# EAGLE design pcb_2 (EAGLE 5.06)
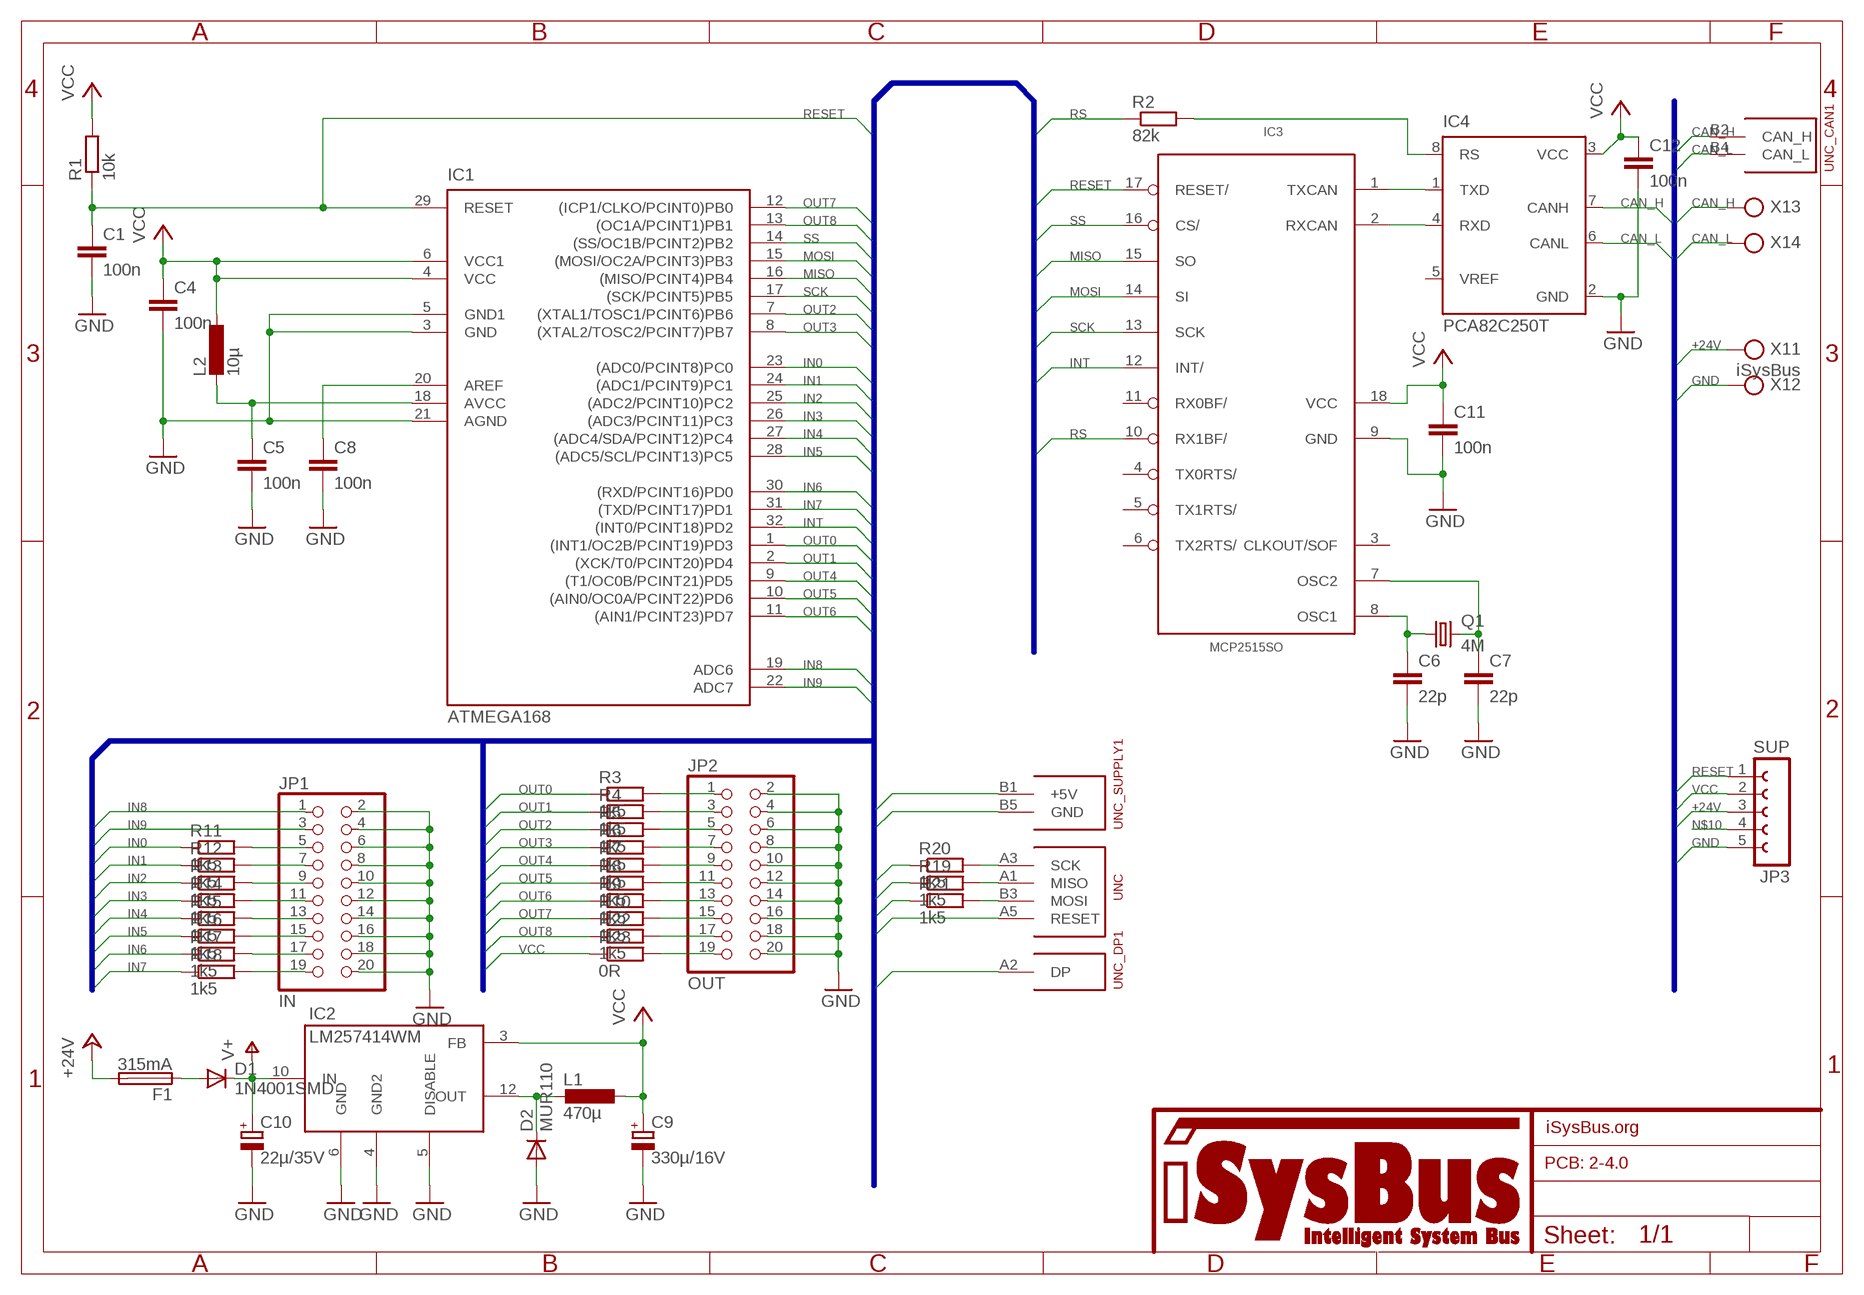
[diagram p0: schematic, sheet 1]

## Parts
C1  100n  CC0805  [C0805]
C4  100n  CC0805  [C0805]
C5  100n  CC0805  [C0805]
C6  22p  CC0805  [C0805]
C7  22p  CC0805  [C0805]
C8  100n  CC0805  [C0805]
C9  330µ/16V  CPOL-EU153CLV-0810  [153CLV-0810]
C10  22µ/35V  CPOL-EU153CLV-0605  [153CLV-0605]
C11  100n  CC0805  [C0805]
C12  100n  CC0805  [C0805]
D1  1N4001SMD  [MELF]
D2  MUR110  [DO41-10]
F1  315mA  19560  [19560]
IC1  ATMEGA168  [TQFP32-08]
IC2  LM257414WM  [14WM]
IC3  MCP2515SO  [SO18L]
IC4  PCA82C250T  [SO08]
JP1  IN  PINHD-2X10  [2X10]
JP2  OUT  PINHD-2X10  [2X10]
JP3  SUP  FE05-1  [FE05-1]
L1  470µ  L-0207/12  [0207/12]
L2  10µ  L-L0805  [L0805]
Q1  4M  CRYSTALHC49UP  [HC49UP]
R1  10k  R-R0805  [R0805]
R2  82k  R-R0805  [R0805]
R3  1k5  R-R0805  [R0805]
R4  1k5  R-R0805  [R0805]
R5  1k5  R-R0805  [R0805]
R6  1k5  R-R0805  [R0805]
R7  1k5  R-R0805  [R0805]
R8  1k5  R-R0805  [R0805]
R9  1k5  R-R0805  [R0805]
R10  1k5  R-R0805  [R0805]
R11  1k5  R-R0805  [R0805]
R12  1k5  R-R0805  [R0805]
R13  1k5  R-R0805  [R0805]
R14  1k5  R-R0805  [R0805]
R15  1k5  R-R0805  [R0805]
R16  1k5  R-R0805  [R0805]
R17  1k5  R-R0805  [R0805]
R18  1k5  R-R0805  [R0805]
R19  1k5  R-R0805  [R0805]
R20  1k5  R-R0805  [R0805]
R21  1k5  R-R0805  [R0805]
R22  1k5  R-R0805  [R0805]
R23  0R  R-R0805  [R0805]
U$1  ISYSBUS_LOGO  [ISYSBUS_LOGO]
U$2  FIELD_ISB_PLACE  [FIELD_ISB_PLACE]
U$3  2-4.0  FIELD_PCB_PLACE  [FIELD_PCB_PLACE]
UNC  UNC_ISP  [UNC_PADS_ISP]
UNC_CAN1  UNC_CAN  [UNC_PADS_CAN]
UNC_DP1  UNC_DP  [UNC_PADS_DP]
UNC_SUPPLY1  UNC_SUPPLY  [UNC_PADS_SUPPLY]
X1  iSysBus  PHOENIX_FK-MPT_4  [PHOENIX_FK-MPT_4]

## Nets
+24V: F1.2 JP3.3 X1.1
CAN_H: IC4.7(CANH) UNC_CAN1.B2(CAN_H) X1.3
CAN_L: IC4.6(CANL) UNC_CAN1.B4(CAN_L) X1.4
GND: C1.2 C4.2 C5.2 C6.2 C7.2 C8.2 C9.- C10.- C11.2 C12.2 D2.A IC1.3(GND) IC1.5(GND1) IC1.21(AGND) IC2.4(GND2) IC2.5(DISABLE) IC2.6(GND) IC3.9(GND) IC4.2(GND) JP1.2 JP1.4 JP1.6 JP1.8 JP1.10 JP1.12 JP1.14 JP1.16 JP1.18 JP1.20 JP2.2 JP2.4 JP2.6 JP2.8 JP2.10 JP2.12 JP2.14 JP2.16 JP2.18 JP2.20 JP3.5 UNC_SUPPLY1.B5(GND) X1.2
IN0: IC1.23((ADC0/PCINT8)PC0) R11.1
IN1: IC1.24((ADC1/PCINT9)PC1) R12.1
IN2: IC1.25((ADC2/PCINT10)PC2) R13.1
IN3: IC1.26((ADC3/PCINT11)PC3) R14.1
IN4: IC1.27((ADC4/SDA/PCINT12)PC4) R15.1
IN5: IC1.28((ADC5/SCL/PCINT13)PC5) R16.1
IN6: IC1.30((RXD/PCINT16)PD0) R17.1
IN7: IC1.31((TXD/PCINT17)PD1) R18.1
IN8: IC1.19(ADC6) JP1.1
IN9: IC1.22(ADC7) JP1.3
INT: IC1.32((INT0/PCINT18)PD2) IC3.12(INT/)
MISO: IC1.16((MISO/PCINT4)PB4) IC3.15(SO) R19.1
MOSI: IC1.15((MOSI/OC2A/PCINT3)PB3) IC3.14(SI) R21.1
N$1: D1.A F1.1
N$2: C5.1 IC1.18(AVCC) L2.2
N$3: D2.C IC2.12(OUT) L1.2
N$4: IC4.8(RS) R2.2
N$5: C6.1 IC3.8(OSC1) Q1.1
N$6: C8.1 IC1.20(AREF)
N$7: IC3.1(TXCAN) IC4.1(TXD)
N$8: IC3.2(RXCAN) IC4.4(RXD)
N$9: C7.1 IC3.7(OSC2) Q1.2
N$10: JP3.4
N$11: JP2.19 R23.2
N$12: JP2.1 R3.2
N$13: JP2.3 R4.2
N$14: JP2.5 R5.2
N$15: JP2.7 R6.2
N$16: JP2.9 R7.2
N$17: JP2.11 R8.2
N$18: JP2.13 R9.2
N$19: JP2.15 R10.2
N$20: JP1.19 R18.2
N$21: JP1.17 R17.2
N$22: JP1.15 R16.2
N$23: JP1.13 R15.2
N$24: JP1.11 R14.2
N$25: JP1.9 R13.2
N$26: JP1.7 R12.2
N$27: JP1.5 R11.2
N$29: R20.2 UNC.A3(SCK)
N$30: R19.2 UNC.A1(MISO)
N$31: R21.2 UNC.B3(MOSI)
N$32: JP2.17 R22.2
OUT0: IC1.1((INT1/OC2B/PCINT19)PD3) R3.1
OUT1: IC1.2((XCK/T0/PCINT20)PD4) R4.1
OUT2: IC1.7((XTAL1/TOSC1/PCINT6)PB6) R5.1
OUT3: IC1.8((XTAL2/TOSC2/PCINT7)PB7) R6.1
OUT4: IC1.9((T1/OC0B/PCINT21)PD5) R7.1
OUT5: IC1.10((AIN0/OC0A/PCINT22)PD6) R8.1
OUT6: IC1.11((AIN1/PCINT23)PD7) R9.1
OUT7: IC1.12((ICP1/CLKO/PCINT0)PB0) R10.1
OUT8: IC1.13((OC1A/PCINT1)PB1) R22.1
RESET: C1.1 IC1.29(RESET) IC3.17(RESET/) JP3.1 R1.1 UNC.A5(RESET)
RS: IC3.10(RX1BF/) R2.1
SCK: IC1.17((SCK/PCINT5)PB5) IC3.13(SCK) R20.1
SS: IC1.14((SS/OC1B/PCINT2)PB2) IC3.16(CS/)
V+: C10.+ D1.C IC2.10(IN)
VCC: C4.1 C9.+ C11.1 C12.1 IC1.4(VCC) IC1.6(VCC1) IC2.3(FB) IC3.18(VCC) IC4.3(VCC) JP3.2 L1.1 L2.1 R1.2 R23.1 UNC_DP1.A2(DP) UNC_SUPPLY1.B1(+5V)
Unconnected: IC3.3(CLKOUT/SOF) IC3.4(TX0RTS/) IC3.5(TX1RTS/) IC3.6(TX2RTS/) IC3.11(RX0BF/) IC4.5(VREF)

## Buses
VCC,GND,RESET,SCK,MISO,MOSI,SS,INT,RS,IN[0..9],OUT[0..8]
+24V,VCC,GND,CAN_H,CAN_L,RESET

## Library data of the parts
C1 C4-C8 C11 C12 = isb_capacitors:C: CAPACITOR, European symbol
C9 C10 = rcl:CPOL-EU: POLARIZED CAPACITOR, European symbol
D1 = isb_diodes:1N4001
D2 = isb_diodes:MUR110
F1 = isb_supply:19560: FUSE HOLDER TR5, Wickmann
IC1 = isb_microcontrollers:ATMEGA168
IC2 = isb_supply:LM2574
IC3 = isb_interfacecontrollers:MCP2515
IC4 = isb_interfacecontrollers:PCA82C250
JP1 JP2 = pinhead:PINHD-2X10: PIN HEADER
JP3 = con-lsta:FE05-1: FEMALE HEADER
L1 L2 = isb_inductors:L: INDUCTOR, European symbol
Q1 = crystal:CRYSTAL: CRYSTAL
R1-R23 = isb_resistors:R: RESISTOR, European symbol
U$1 = isysbus_misc:ISYSBUS_LOGO: iSysBus Logo
U$2 = isb_misc:FIELD_ISB
U$3 = isb_misc:FIELD_PCB
UNC = isb_connectors:UNC_ISP: ISP-Schnittstelle Für korrekte Funktionsweise wird UNC_SUPPLY benötigt!
UNC_CAN1 = isb_connectors:UNC_CAN: CAN-Schnittstelle Für korrekten Betrieb wird UNC_SUPPLY benötigt!
UNC_DP1 = isb_connectors:UNC_DP: Wird der DP-Pin eines UNC mit +5V verbunden, kann ein angeschlossenes Gerät automatisch erkannt werden
UNC_SUPPLY1 = isb_connectors:UNC_SUPPLY: Spannungsversorgung für UNC
X1 = isb_connectors:PHOENIX_FK-MPT_4

## Board
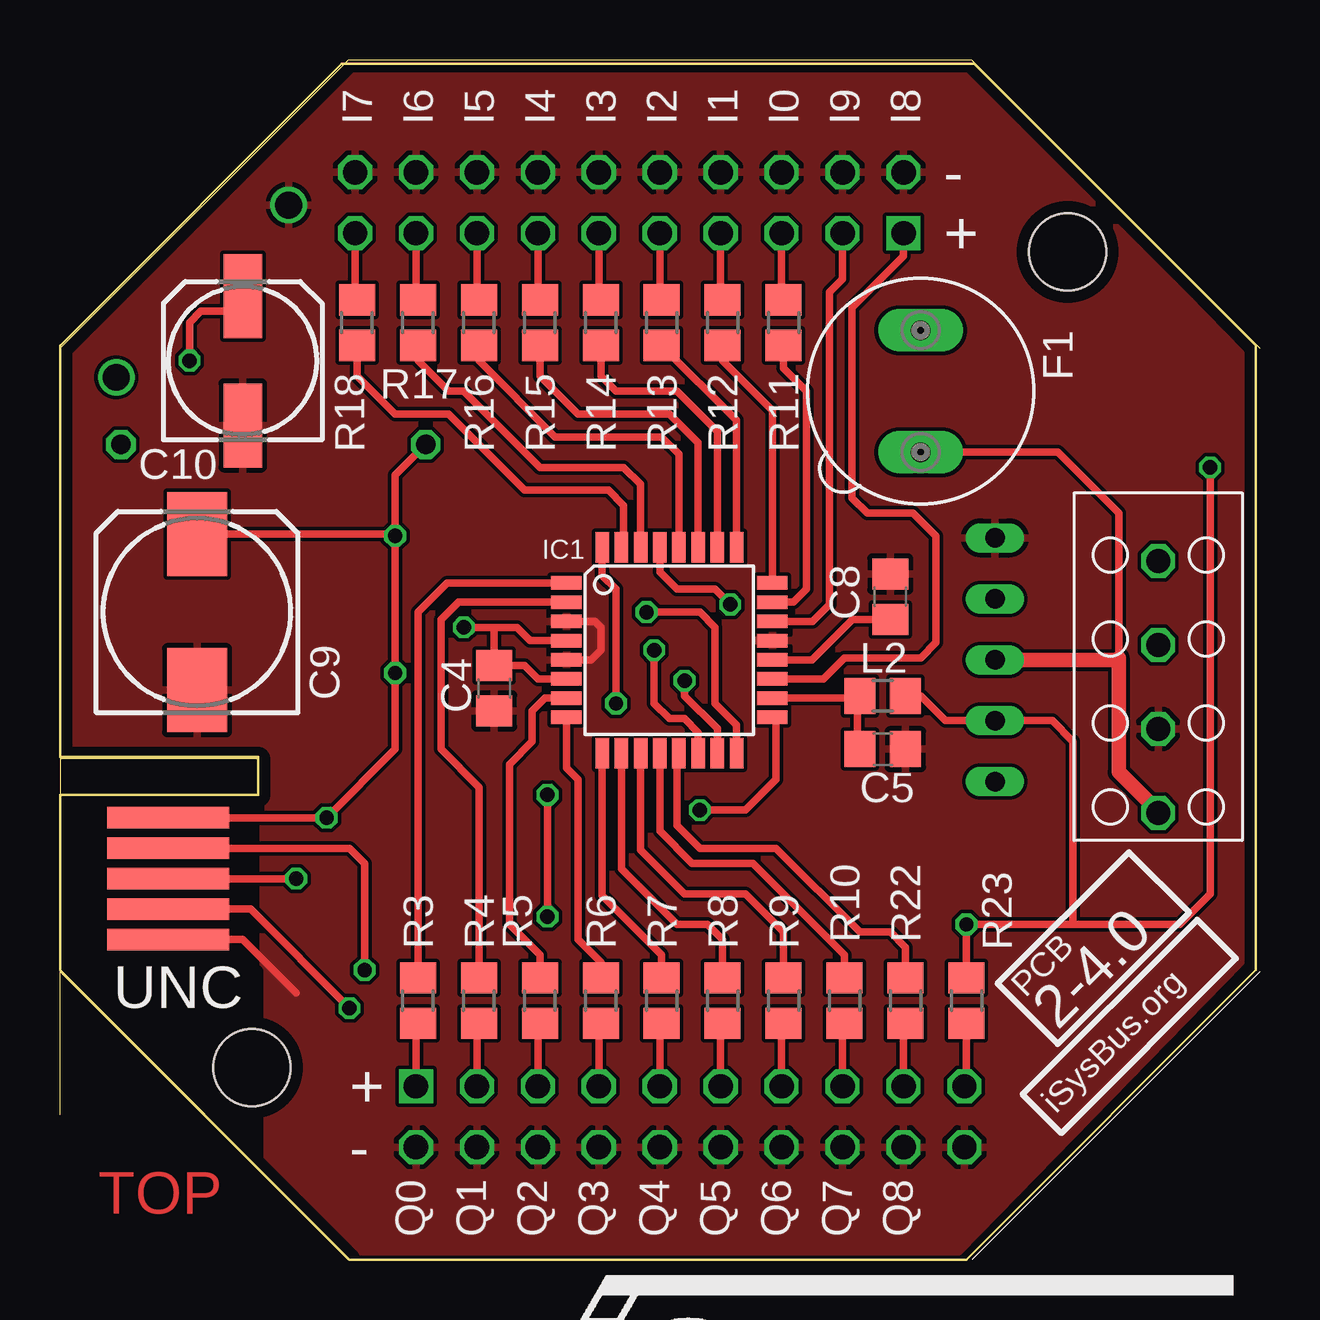
[diagram p1: board, top side]
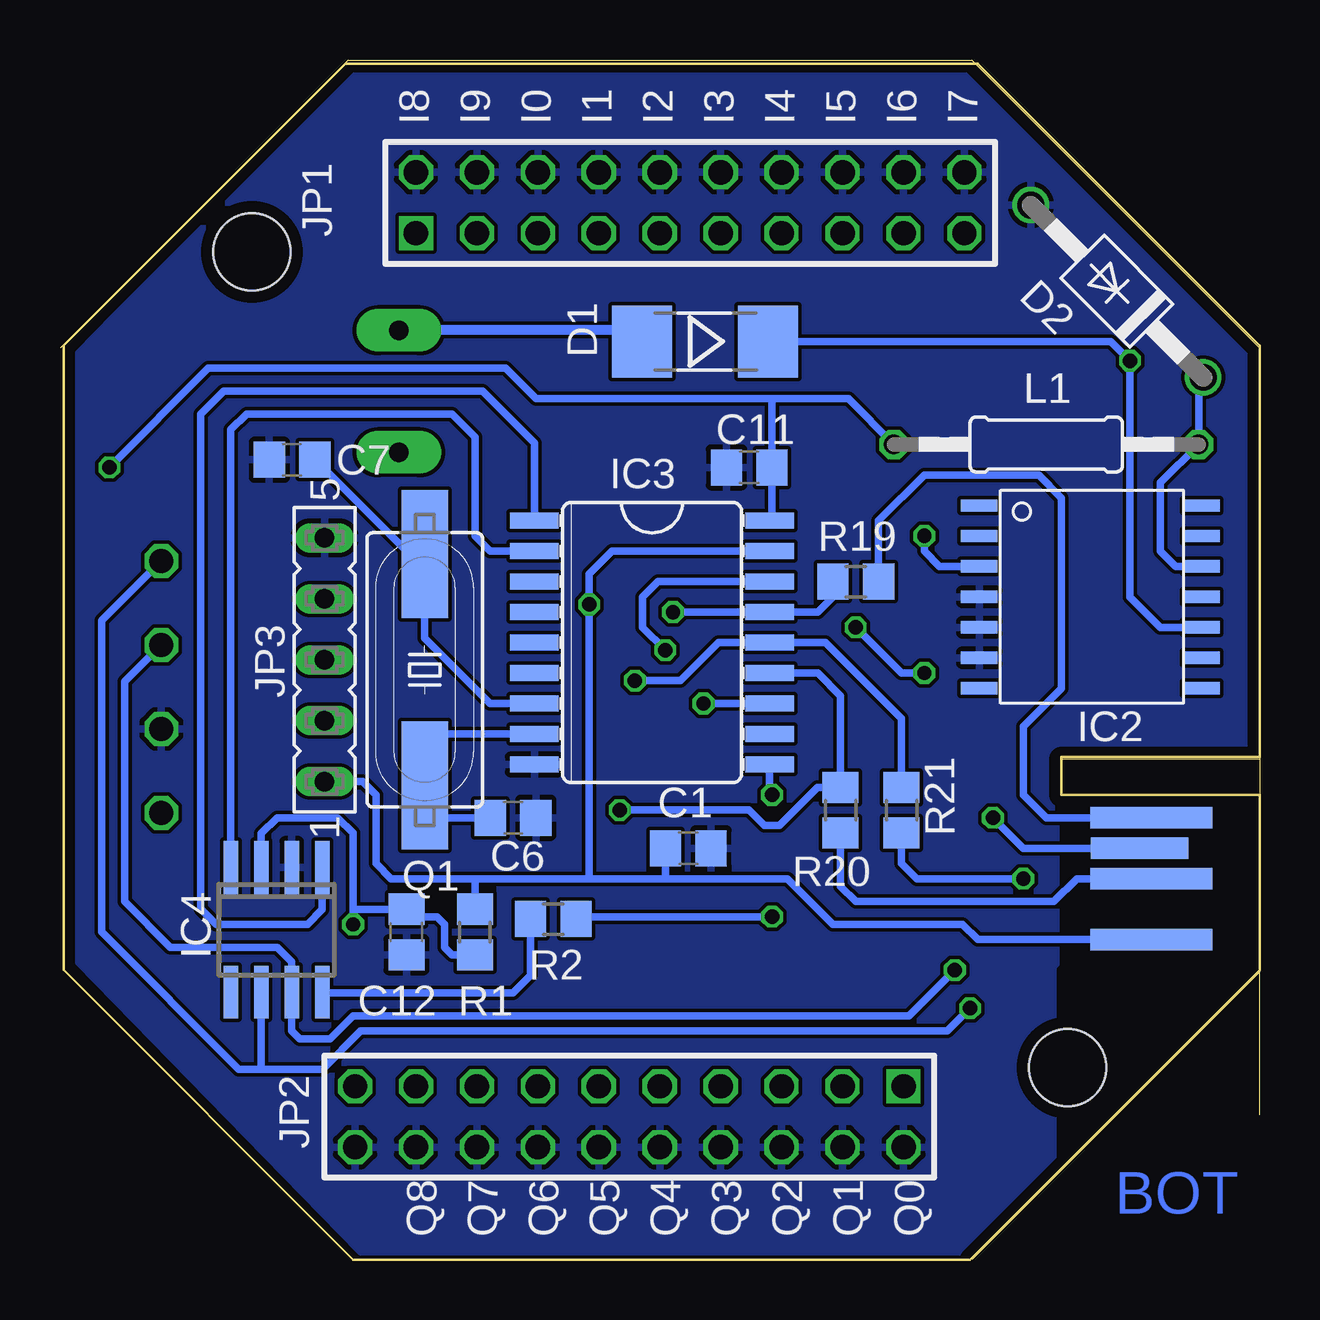
[diagram p2: board, bottom side, seen from below]

Size 50 x 50 mm. Coordinates in mm from the lower left corner, seen from the top.
Outline: 50,38 38,50 12,50 0,38 0,12 12,0
Copper layers (1*16): Top 0.035mm / dielectric 1.5mm / Bottom 0.035mm
Design rules: minimum track width 6mil, minimum drill 12mil, track to track 6mil, track to pad 6mil, pad to pad 6mil, via to via 6mil, smd to smd 6mil, copper to edge 20mil, drill to drill 8mil, minimum pad ring 8mil, minimum via ring 6mil, stop-mask expansion 3mil, vias tented up to drill 0mil, thermal gap 8mil
Holes 3.2 mm at 8,8 42,42
tKeepout: area 6.1,6.1 to 12.1,12.1; area 37.6,37.6 to 43.6,43.6
bKeepout: area 6.1,6.1 to 12.1,12.1; area 37.6,37.6 to 43.6,43.6
tRestrict: area 0,4.4 to 8.3,12.1
bRestrict: area 0,4.4 to 8.3,12.1
Milling: 12 lines

### Footprints (pad centres in the part's own frame; a part is rotated, then mirrored left to right if it is on the bottom)
C0805 = smd 1.3 x 1.5: 1 -0.95,0; 2 0.95,0
153CLV-0810 = smd 3.5 x 2.5: + 3.25,0; - -3.25,0
153CLV-0605 = smd 3.5 x 1.6: + 2.7,0; - -2.7,0
MELF = smd 2.5 x 3: A 2.625,0; C -2.625,0
DO41-10 = drill 1.118: A 5.08,0; C -5.08,0
19560 = drill 0.813 pad 1.778 long: 1 -2.54,0; 2 2.54,0
TQFP32-08 = smd 1.27 x 0.559: 1 -4.293,2.8; 2 -4.293,2; 3 -4.293,1.2; 4 -4.293,0.4; 5 -4.293,-0.4; 6 -4.293,-1.2; 7 -4.293,-2; 8 -4.293,-2.8; 17 4.293,-2.8; 18 4.293,-2; 19 4.293,-1.2; 20 4.293,-0.4; 21 4.293,0.4; 22 4.293,1.2; 23 4.293,2; 24 4.293,2.8 | smd 0.559 x 1.27: 9 -2.8,-4.293; 10 -2,-4.293; 11 -1.2,-4.293; 12 -0.4,-4.293; 13 0.4,-4.293; 14 1.2,-4.293; 15 2,-4.293; 16 2.8,-4.293; 25 2.8,4.293; 26 2,4.293; 27 1.2,4.293; 28 0.4,4.293; 29 -0.4,4.293; 30 -1.2,4.293; 31 -2,4.293; 32 -2.8,4.293
14WM = smd 0.508 x 1.524: 1 -3.175,-4.699; 2 -1.905,-4.699; 3 -0.635,-4.699; 4 0.635,-4.699; 5 1.905,-4.699; 6 3.175,-4.699; 7 4.445,-4.699; 8 4.445,4.572; 9 3.175,4.572; 10 1.905,4.572; 11 0.635,4.572; 12 -0.635,4.572; 13 -1.905,4.572; 14 -3.175,4.572
SO18L = smd 0.66 x 2.032: 1 -5.08,-4.902; 2 -3.81,-4.902; 3 -2.54,-4.902; 4 -1.27,-4.902; 5 0,-4.902; 6 1.27,-4.902; 7 2.54,-4.902; 8 3.81,-4.902; 9 5.08,-4.902; 10 5.08,4.902; 11 3.81,4.902; 12 2.54,4.902; 13 1.27,4.902; 14 0,4.902; 15 -1.27,4.902; 16 -2.54,4.902; 17 -3.81,4.902; 18 -5.08,4.902
SO08 = smd 0.6 x 2.2: 1 -1.905,-2.6; 2 -0.635,-2.6; 3 0.635,-2.6; 4 1.905,-2.6; 5 1.905,2.6; 6 0.635,2.6; 7 -0.635,2.6; 8 -1.905,2.6
2X10 = drill 1.016 square: 1 -11.43,-1.27 | drill 1.016 octagon: 2 -11.43,1.27; 3 -8.89,-1.27; 4 -8.89,1.27; 5 -6.35,-1.27; 6 -6.35,1.27; 7 -3.81,-1.27; 8 -3.81,1.27; 9 -1.27,-1.27; 10 -1.27,1.27; 11 1.27,-1.27; 12 1.27,1.27; 13 3.81,-1.27; 14 3.81,1.27; 15 6.35,-1.27; 16 6.35,1.27; 17 8.89,-1.27; 18 8.89,1.27; 19 11.43,-1.27; 20 11.43,1.27
FE05-1 = drill 0.813 long: 1 -5.08,0; 2 -2.54,0; 3 0,0; 4 2.54,0; 5 5.08,0
0207/12 = drill 0.813 octagon: 1 -6.35,0; 2 6.35,0
L0805 = smd 1.3 x 1.5: 1 -0.95,0; 2 0.95,0
HC49UP = smd 5.334 x 1.93: 1 -4.826,0; 2 4.826,0
R0805 = smd 1.3 x 1.5: 1 -0.95,0; 2 0.95,0
UNC_PADS_ISP = smd 0.91 x 5.08 bottom: A1 2.54,4.508; A3 5.08,4.508; A5 7.62,4.508 | smd 0.91 x 5.08: B3 5.08,4.508
UNC_PADS_CAN = smd 0.91 x 5.08: B2 3.81,4.508; B4 6.35,4.508
UNC_PADS_DP = smd 0.91 x 4.08 bottom: A2 3.81,5
UNC_PADS_SUPPLY = smd 0.91 x 5.08: B1 2.54,4.508; B5 7.62,4.508
PHOENIX_FK-MPT_4 = drill 1 octagon: 1 -5.25,0; 2 -1.75,0; 3 1.75,0; 4 5.25,0

### Placement (x,y rotation side)
C1  23.81,17.14 0 bottom
C4  18.1,23.81 270 top
C5  34.29,21.27 0 top
C6  31.11,18.41 0 bottom
C7  40.32,33.34 180 bottom
C8  34.61,27.62 90 top
C9  5.71,26.99 90 top
C10  7.62,37.47 90 top
C11  21.27,33.02 180 bottom
C12  35.56,13.65 270 bottom
D1  23.12,38.26 180 bottom
D2  5.94,40.36 135 bottom
F1  35.88,36.2 270 top
IC1  25.4,25.4 0 top
IC2  6.99,28.26 270 bottom
IC3  25.32,25.72 270 bottom
IC4  40.97,13.75 180 bottom
JP1  23.73,44.05 0 bottom
JP2  26.27,5.95 180 bottom
JP3  38.97,25 90 bottom
L1  8.89,33.97 0 bottom
L2  34.29,23.5 180 top
Q1  34.79,24.58 90 bottom
R1  32.7,13.65 270 bottom
R2  29.43,14.19 180 bottom
R3  14.92,10.79 270 top
R4  17.46,10.79 270 top
R5  20,10.79 270 top
R6  22.54,10.79 270 top
R7  25.08,10.79 270 top
R8  27.62,10.79 270 top
R9  30.16,10.79 270 top
R10  32.7,10.79 270 top
R11  30.16,39.05 90 top
R12  27.62,39.05 90 top
R13  25.08,39.05 90 top
R14  22.54,39.05 90 top
R15  20,39.05 90 top
R16  17.46,39.05 90 top
R17  14.92,39.05 90 top
R18  12.38,39.05 90 top
R19  16.83,28.26 0 bottom
R20  17.46,18.73 270 bottom
R21  14.92,18.73 270 bottom
R22  35.24,10.79 270 top
R23  37.78,10.79 270 top
U$1  21.59,-10.79 0 top  (outside the outline)
U$2  42.64,4.91 45 top
U$3  41.59,9.53 45 top
UNC  0,20.95 270 top
UNC_CAN1  0,20.95 270 top
UNC_DP1  0,20.95 270 top
UNC_SUPPLY1  0,20.95 270 top
X1  45.77,23.87 90 top

### Tracks (layer width: path | path; a pad name or v marks a point on that pad's centre or on a via)
+24V
  Top 0.305: 45.77,18.68 X1.1 | 44.05,25 44.13,25.08 44.13,31.11 41.59,33.66 F1.2
  Top 0.61: 45.77,18.68 44.13,20.32 44.13,25.08 | JP3.3 44.05,25
CAN_H  (via drill 0.6)
  Top 0.305: UNC_CAN1.B2 12.06,17.14 12.7,16.51 v12.7,12.06
  Bottom 0.305: X1.3 47.31,24.08 47.31,14.92 45.4,13.02 40.96,13.02 40.34,12.4 IC4.7 40.34,9.54 40.01,9.21 38.73,9.21 37.78,10.16 14.61,10.16 v12.7,12.06
CAN_L  (via drill 0.6)
  Top 0.305: UNC_CAN1.B4 7.94,14.61 v12.06,10.48
  Bottom 0.305: 41.61,7.95 IC4.6 | X1.4 48.26,26.63 48.26,13.65 42.55,7.94 41.62,7.94 41.61,7.95 | 41.61,7.95 41.59,7.94 39.05,7.94 37.47,9.53 13.02,9.53 v12.06,10.48
GND
  Top 0.305: IC1.5 22.14,25 22.54,25.4 22.54,26.35 22.3,26.6 IC1.3 | UNC_SUPPLY1.B5 7.62,13.34 9.84,11.11
  pour Bottom: 0.32,37.78 12.06,49.53 37.78,49.53 49.21,37.78 49.21,12.38 37.47,0.32 12.38,0.32 0.32,12.06
  pour Top: 0.32,37.78 12.06,49.53 37.78,49.53 49.21,37.78 49.21,12.38 37.47,0.32 12.38,0.32 0.32,12.06
IN0
  Top 0.305: IC1.23 30.57,27.4 31.11,27.94 31.11,36.2 30.16,37.15 R11.1
IN1
  Top 0.305: R12.1 27.62,37.47 29.69,35.4 IC1.24
IN2
  Top 0.305: IC1.25 28.2,34.98 R13.1
IN3
  Top 0.305: IC1.26 27.4,34.51 25.72,36.2 23.18,36.2 22.54,36.83 R14.1
IN4
  Top 0.305: IC1.27 26.6,34.04 25.4,35.24 21.59,35.24 20,36.83 R15.1
IN5
  Top 0.305: IC1.28 25.8,33.57 25.08,34.29 20.64,34.29 17.46,37.47 R16.1
IN6
  Top 0.305: IC1.30 24.2,32.31 23.5,33.02 20,33.02 16.83,36.2 16.19,36.2 14.92,37.47 R17.1
IN7
  Top 0.305: IC1.31 23.5,29.79 23.5,31.43 22.86,32.07 19.37,32.07 16.19,35.24 13.97,35.24 12.38,36.83 R18.1
IN8
  Top 0.305: 29.76,24.13 IC1.19 31.82,24.2 32.7,25.08 35.88,25.08 36.51,25.72 36.51,30.16 35.56,31.11 33.66,31.11 33.02,31.75 33.02,39.69 35.16,41.83 JP1.1
IN9
  Top 0.305: IC1.22 31.36,26.6 32.07,27.3 32.07,37.15 32.07,40.32 32.62,40.88 JP1.3
INT  (via drill 0.6)
  Top 0.305: IC1.32 22.6,28.52 23.18,27.94 v23.18,23.18
  Bottom 0.305: IC3.12 v23.18,23.18
MISO  (via drill 0.6)
  Top 0.305: IC1.16 28.2,22.28 27.3,23.18 27.3,26.35 26.67,26.99 v24.45,26.99
  Bottom 0.305: v24.45,26.99 IC3.15 18.41,26.99 17.78,27.62 R19.1
MOSI  (via drill 0.6)
  Top 0.305: 27.4,20.79 IC1.15 27.4,22.13 26.04,23.5 v26.04,24.13
  Bottom 0.305: R21.1 14.92,22.54 18.1,25.72 IC3.14 22.54,25.72 24.13,24.13 v26.04,24.13
N$1
  Bottom 0.406: F1.1 26.22,38.73 D1.A
N$2
  Top 0.305: IC1.18 33.24,23.4 | 33.24,23.4 L2.2 | 33.24,23.4 33.24,21.37 C5.1
N$3
  Bottom 0.305: IC2.12 3.49,28.89 4.13,29.53 4.13,32.38 L1.2 2.54,36.58 D2.C
N$4
  Bottom 0.305: R2.2 30.39,11.84 31.11,11.11 39.04,11.11 IC4.8
N$5
  Bottom 0.305: 34.29,21.91 34.61,22.23 | 34.29,21.91 IC3.8 | 34.29,21.91 34.79,21.4 Q1.1 34.92,19.94 34.92,18.73 34.61,18.41 C6.1
N$6
  Top 0.305: IC1.20 31.35,25 33.02,26.67 C8.1
N$7
  Bottom 0.305: IC4.1 39.07,14.59 39.69,13.97 43.5,13.97 44.13,14.61 44.13,35.24 43.18,36.2 32.38,36.2 30.23,34.03 IC3.1
N$8
  Bottom 0.305: IC3.2 32.07,29.53 32.7,30.16 32.7,34.29 33.66,35.24 42.23,35.24 42.88,34.59 IC4.4
N$9
  Bottom 0.305: IC3.7 32.07,23.18 34.79,25.9 Q1.2 | C7.1 35.56,29.53 34.92,29.53 Q1.2 | 34.61,30.16 34.61,29.91 Q1.2
N$11
  Top 0.305: JP2.19 37.78,7.22 R23.2
N$12
  Top 0.305: JP2.1 14.84,9.76 R3.2
N$13
  Top 0.305: JP2.3 17.38,9.76 R4.2
N$14
  Top 0.305: JP2.5 19.92,9.76 R5.2
N$15
  Top 0.305: JP2.7 22.46,9.76 R6.2
N$16
  Top 0.305: JP2.9 25,9.76 R7.2
N$17
  Top 0.305: JP2.11 27.54,9.76 R8.2
N$18
  Top 0.305: JP2.13 30.08,9.76 R9.2
N$19
  Top 0.305: JP2.15 32.62,9.76 R10.2
N$20
  Top 0.305: JP1.19 12.3,40.09 R18.2
N$21
  Top 0.305: JP1.17 14.84,40.09 R17.2
N$22
  Top 0.305: JP1.15 17.38,40.09 R16.2
N$23
  Top 0.305: JP1.13 19.92,40.09 R15.2
N$24
  Top 0.305: JP1.11 22.46,40.09 R14.2
N$25
  Top 0.305: JP1.9 25,40.09 R13.2
N$26
  Top 0.305: JP1.7 27.54,40.09 R12.2
N$27
  Top 0.305: JP1.5 30.08,40.09 R11.2
N$29
  Bottom 0.305: 13.97,14.92 13.65,14.92 | 13.97,14.92 16.83,14.92 17.46,15.56 R20.2 | UNC.A3 7.62,15.88 8.57,14.92 13.97,14.92
N$30
  Bottom 0.305: R19.2 15.88,30.8 13.97,32.7 9.21,32.7 8.26,31.75 8.26,23.81 9.84,22.23 9.84,20 9.84,19.37 8.89,18.41 UNC.A1
N$31  (via drill 0.6)
  Top 0.305: UNC.B3 v9.84,15.88
  Bottom 0.305: R21.2 14.92,16.51 14.29,15.88 v9.84,15.88
N$32
  Top 0.305: JP2.17 35.16,9.76 R22.2
OUT0
  Top 0.305: IC1.1 16.14,28.2 14.92,26.99 R3.1
OUT1
  Top 0.305: IC1.2 16.61,27.4 15.88,26.67 15.88,21.27 17.46,19.68 R4.1
OUT2
  Top 0.305: IC1.7 20.23,23.4 19.68,22.86 19.68,21.59 19.37,21.27 19.05,20.95 18.73,20.64 18.73,13.97 20,12.7 R5.1
OUT3
  Top 0.305: IC1.8 21.11,20.48 21.59,20 21.59,13.34 22.54,12.38 R6.1
OUT4
  Top 0.305: R7.1 25.08,12.7 22.6,15.18 IC1.9
OUT5
  Top 0.305: IC1.10 23.4,16.29 25.72,13.97 26.99,13.97 27.62,13.34 R8.1
OUT6
  Top 0.305: IC1.11 24.2,17.07 26.04,15.24 28.57,15.24 30.16,13.65 R9.1
OUT7
  Top 0.305: R10.1 32.7,12.7 28.89,16.51 26.35,16.51 25,17.86 25,19.6 IC1.12
OUT8
  Top 0.305: R22.1 35.24,13.02 34.61,13.65 33.34,13.65 29.84,17.14 26.67,17.14 25.72,18.1 25.72,19.37 25.72,21.11 IC1.13
RESET  (via drill 0.6)
  Top 0.305: IC1.29 25,28.66 25.72,27.94 27.3,27.94 v27.94,27.3
  Bottom 0.305: IC3.17 26.99,29.53 27.94,28.57 v27.94,27.3 27.94,15.88 | JP3.1 37.38,19.92 36.83,19.37 36.83,16.51 36.2,15.88 32.7,15.88 | C1.1 24.77,15.88 | 24.77,15.88 19.68,15.88 17.78,13.97 12.38,13.97 11.75,13.34 UNC.A5 | 24.77,15.88 27.94,15.88 | 27.94,15.88 32.7,15.88 | 32.7,15.88 R1.1
RS  (via drill 0.6)
  Top 0.305: v20.32,14.29 v20.32,19.37
  Bottom 0.305: IC3.10 20.42,19.47 v20.32,19.37 | R2.1 28.57,14.29 v20.32,14.29
SCK  (via drill 0.6)
  Top 0.305: v26.67,18.73 28.57,18.73 29.84,20 29.84,22.45 IC1.17
  Bottom 0.305: IC3.13 18.41,24.45 17.46,23.5 R20.1 18.42,19.68 20,18.1 20.64,18.1 21.27,18.73 v26.67,18.73
SS  (via drill 0.6)
  Top 0.305: v24.77,25.4 24.77,23.18 25.4,22.54 26.04,22.54 26.6,21.98 IC1.14
  Bottom 0.305: v24.77,25.4 25.72,26.35 25.72,27.62 25.08,28.26 IC3.16
V+  (via drill 0.6)
  Top 0.305: C10.+ 7.46,40.01 7.46,39.53 5.87,39.53 5.4,39.05 v5.4,37.47
  Bottom 0.305: IC2.10 4.13,26.35 5.4,27.62 v5.4,37.47 6.2,38.26 D1.C
VCC  (via drill 0.6)
  Top 0.305: IC1.4 19.6,25.8 19.05,26.35 18.1,26.35 | v16.83,26.35 18.1,26.35 | IC1.6 19.93,24.2 19.37,24.77 C4.1 18.1,26.35 | v13.97,30.16 v13.97,24.45 13.97,21.27 v11.11,18.41 UNC_SUPPLY1.B1 | C9.+ 13.89,30.24 v13.97,30.16 | v13.97,30.16 13.97,32.7 L1.1 | 42.23,13.97 42.23,21.59 41.36,22.46 JP3.2 36.91,22.46 35.88,23.5 L2.1 | 42.23,13.97 v37.78,13.97 R23.1 | v47.94,33.02 47.94,15.24 46.67,13.97 42.23,13.97
  Bottom 0.305: v13.97,24.45 14.92,24.45 v16.83,26.35 | v13.97,30.16 13.97,29.53 13.34,28.89 IC2.3 | IC4.3 41.61,17.76 40.96,18.41 38.42,18.41 37.78,17.78 37.78,14.61 | IC3.18 20.32,30.9 C11.1 20.32,35.88 | L1.1 17.14,35.88 20.32,35.88 | 20.32,35.88 30.16,35.88 31.43,37.15 43.81,37.15 v47.94,33.02 | R1.2 33.66,12.7 33.97,13.02 33.97,13.97 34.29,14.29 35.24,14.29 C12.1 37.78,14.6 37.78,14.61 | v37.78,13.97 37.78,14.61 | UNC_DP1.A2 9.84,17.14 v11.11,18.41

### Text on the board
Top: TOP
Bottom: BOT
tNames: I7 | I6 | I5 | I4 | I3 | I2 | I1 | I0 | I9 | I8 | - | + | + | - | Q0 | Q1 | Q2 | Q3 | Q4 | Q5 | Q6 | Q7 | Q8
bNames: I7 | I6 | I5 | I4 | I3 | I2 | I1 | I0 | I9 | I8 | Q0 | Q1 | Q2 | Q3 | Q4 | Q5 | Q6 | Q7 | Q8